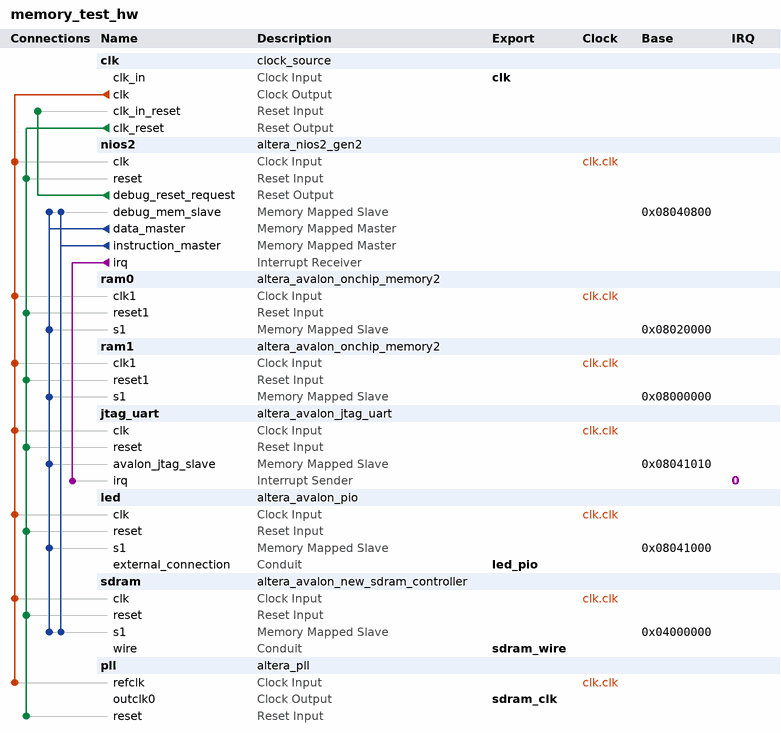
[diagram p0: system contents]
# Platform Designer (Qsys) system memory_test_hw, Cyclone V 5CSEMA5F31C6
# Parameters at their usual value, and those the tool derives, are not listed.
package require -exact qsys 18.1
create_system memory_test_hw
set_project_property DEVICE_FAMILY {Cyclone V}
set_project_property DEVICE 5CSEMA5F31C6

add_instance clk clock_source 18.1
set_instance_parameter_value clk clockFrequency 50000000

add_instance nios2 altera_nios2_gen2 18.1
set_instance_parameter_value nios2 dcache_size 2048
set_instance_parameter_value nios2 exceptionSlave sdram.s1
set_instance_parameter_value nios2 icache_size 4096
set_instance_parameter_value nios2 impl Tiny
set_instance_parameter_value nios2 resetSlave sdram.s1

add_instance ram0 altera_avalon_onchip_memory2 18.1
set_instance_parameter_value ram0 dataWidth 32
set_instance_parameter_value ram0 dualPort false
set_instance_parameter_value ram0 initMemContent true
set_instance_parameter_value ram0 initializationFileName onchip_mem.hex
set_instance_parameter_value ram0 memorySize 131072

add_instance ram1 altera_avalon_onchip_memory2 18.1
set_instance_parameter_value ram1 dataWidth 32
set_instance_parameter_value ram1 dualPort false
set_instance_parameter_value ram1 initMemContent true
set_instance_parameter_value ram1 initializationFileName onchip_mem.hex
set_instance_parameter_value ram1 memorySize 131072

add_instance jtag_uart altera_avalon_jtag_uart 18.1
set_instance_parameter_value jtag_uart simInteractiveOptions NO_INTERACTIVE_WINDOWS

add_instance led altera_avalon_pio 18.1
set_instance_parameter_value led direction Output
set_instance_parameter_value led width 8

add_instance sdram altera_avalon_new_sdram_controller 18.1
set_instance_parameter_value sdram TAC 5.5
set_instance_parameter_value sdram TRCD 20.0
set_instance_parameter_value sdram TRP 20.0
set_instance_parameter_value sdram casLatency 3
set_instance_parameter_value sdram columnWidth 10
set_instance_parameter_value sdram dataWidth 16
set_instance_parameter_value sdram generateSimulationModel false
set_instance_parameter_value sdram model single_Micron_MT48LC4M32B2_7_chip
set_instance_parameter_value sdram numberOfBanks 4
set_instance_parameter_value sdram numberOfChipSelects 1
set_instance_parameter_value sdram powerUpDelay 100.0
set_instance_parameter_value sdram refreshPeriod 15.625
set_instance_parameter_value sdram rowWidth 13

add_instance pll altera_pll 18.1
set_instance_parameter_value pll gui_device_speed_grade 1
set_instance_parameter_value pll gui_number_of_clocks 1
set_instance_parameter_value pll gui_operation_mode normal
set_instance_parameter_value pll gui_output_clock_frequency0 50.0
set_instance_parameter_value pll gui_phase_shift0 -3000
set_instance_parameter_value pll gui_pll_mode {Integer-N PLL}
set_instance_parameter_value pll gui_reference_clock_frequency 50.0
set_instance_parameter_value pll gui_use_locked false

# connections
add_connection clk.clk jtag_uart.clk clock
add_connection clk.clk led.clk clock
add_connection clk.clk nios2.clk clock
add_connection clk.clk pll.refclk clock
add_connection clk.clk ram0.clk1 clock
add_connection clk.clk ram1.clk1 clock
add_connection clk.clk sdram.clk clock
add_connection clk.clk_reset jtag_uart.reset reset
add_connection clk.clk_reset led.reset reset
add_connection clk.clk_reset nios2.reset reset
add_connection clk.clk_reset pll.reset reset
add_connection clk.clk_reset ram0.reset1 reset
add_connection clk.clk_reset ram1.reset1 reset
add_connection clk.clk_reset sdram.reset reset
add_connection nios2.debug_reset_request clk.clk_in_reset reset
add_connection nios2.data_master jtag_uart.avalon_jtag_slave avalon
set_connection_parameter_value nios2.data_master/jtag_uart.avalon_jtag_slave baseAddress 0x08041010
add_connection nios2.data_master led.s1 avalon
set_connection_parameter_value nios2.data_master/led.s1 baseAddress 0x08041000
add_connection nios2.data_master nios2.debug_mem_slave avalon
set_connection_parameter_value nios2.data_master/nios2.debug_mem_slave baseAddress 0x08040800
add_connection nios2.data_master ram0.s1 avalon
set_connection_parameter_value nios2.data_master/ram0.s1 baseAddress 0x08020000
add_connection nios2.data_master ram1.s1 avalon
set_connection_parameter_value nios2.data_master/ram1.s1 baseAddress 0x08000000
add_connection nios2.data_master sdram.s1 avalon
set_connection_parameter_value nios2.data_master/sdram.s1 baseAddress 0x04000000
add_connection nios2.instruction_master nios2.debug_mem_slave avalon
set_connection_parameter_value nios2.instruction_master/nios2.debug_mem_slave baseAddress 0x08040800
add_connection nios2.instruction_master sdram.s1 avalon
set_connection_parameter_value nios2.instruction_master/sdram.s1 baseAddress 0x04000000
add_connection nios2.irq jtag_uart.irq interrupt
set_connection_parameter_value nios2.irq/jtag_uart.irq irqNumber 0

# exported interfaces
add_interface clk clock sink
set_interface_property clk EXPORT_OF clk.clk_in
add_interface led_pio conduit end
set_interface_property led_pio EXPORT_OF led.external_connection
add_interface sdram_clk clock source
set_interface_property sdram_clk EXPORT_OF pll.outclk0
add_interface sdram_wire conduit end
set_interface_property sdram_wire EXPORT_OF sdram.wire

set_interconnect_requirement {$system} qsys_mm.clockCrossingAdapter HANDSHAKE
set_interconnect_requirement {$system} qsys_mm.enableEccProtection FALSE
set_interconnect_requirement {$system} qsys_mm.insertDefaultSlave FALSE
set_interconnect_requirement {$system} qsys_mm.maxAdditionalLatency 1

save_system memory_test_hw.qsys
